# EAGLE schematic untitled (EAGLE 9.1.3)
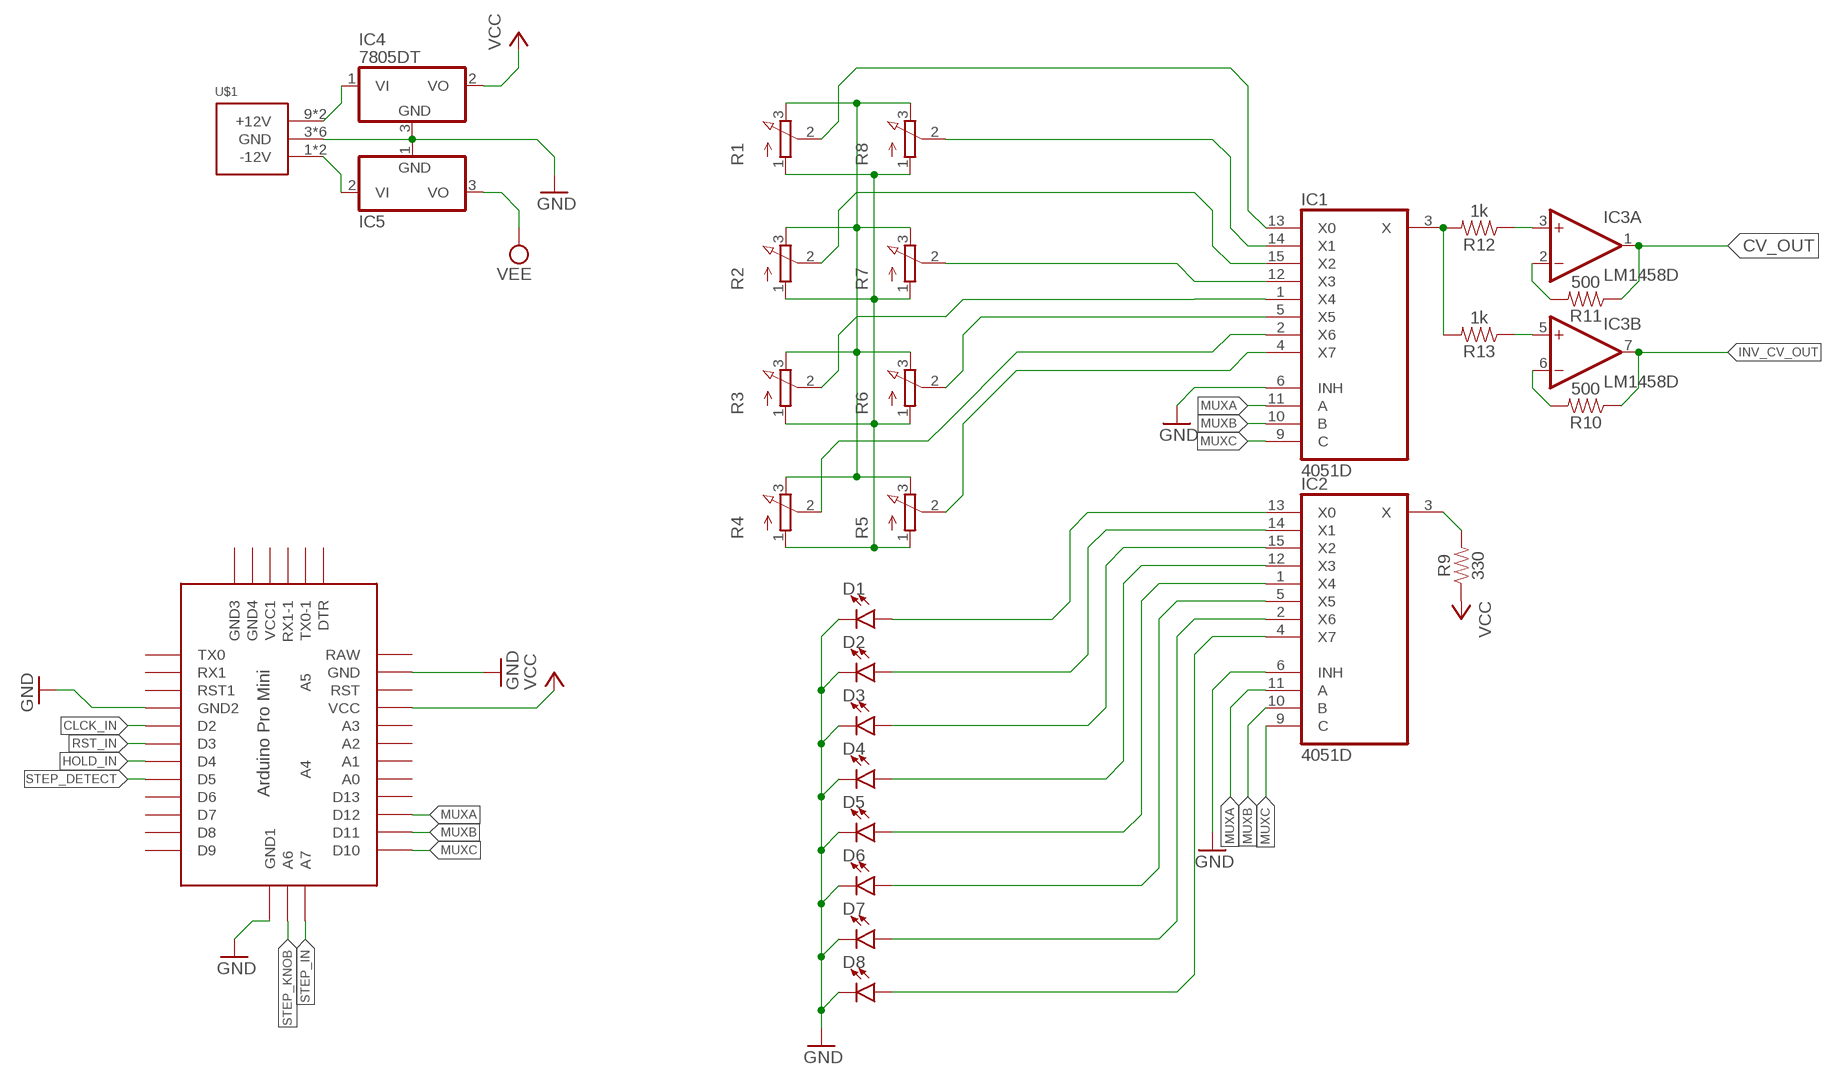
[diagram p0: schematic, sheet 1]

## Parts
D1  LED5MM  [LED_5MM]
D2  LED5MM  [LED_5MM]
D3  LED5MM  [LED_5MM]
D4  LED5MM  [LED_5MM]
D5  LED5MM  [LED_5MM]
D6  LED5MM  [LED_5MM]
D7  LED5MM  [LED_5MM]
D8  LED5MM  [LED_5MM]
IC1  4051D  [SO16]
IC2  4051D  [SO16]
IC3  LM1458D  [SO08]
IC4  7805DT  [TO252]
IC5  7905T  [TO220H]
R1  3RP/1610N  [3RP/1610N]
R2  3RP/1610N  [3RP/1610N]
R3  3RP/1610N  [3RP/1610N]
R4  3RP/1610N  [3RP/1610N]
R5  3RP/1610N  [3RP/1610N]
R6  3RP/1610N  [3RP/1610N]
R7  3RP/1610N  [3RP/1610N]
R8  3RP/1610N  [3RP/1610N]
R9  330  330OHM-HORIZ-1/10W-5%  [AXIAL-0.3]
R10  500  330OHM-HORIZ-1/10W-5%  [AXIAL-0.3]
R11  500  330OHM-HORIZ-1/10W-5%  [AXIAL-0.3]
R12  1k  330OHM-HORIZ-1/10W-5%  [AXIAL-0.3]
R13  1k  330OHM-HORIZ-1/10W-5%  [AXIAL-0.3]
U$1  POWER_SIMPLE10  [POWER_10]
U$2  ABK-PRO-MINI  [ABK-PRO-MINI]

## Nets
CLCK_IN: U$2.D2
CV_OUT: IC3.1(A:OUT) R11.P$1
GND: D1.K(C) D2.K(C) D3.K(C) D4.K(C) D5.K(C) D6.K(C) D7.K(C) D8.K(C) IC1.6(INH) IC2.6(INH) IC4.3(GND) IC5.1(GND) U$1.3(GND) U$1.4(GND) U$1.5(GND) U$1.6(GND) U$1.7(GND) U$1.8(GND) U$2.GND U$2.GND1(GND2) U$2.GND4(GND1)
HOLD_IN: U$2.D4
INV_CV_OUT: IC3.7(B:OUT) R10.P$1
MUXA: IC1.11(A) IC2.11(A) U$2.D12
MUXB: IC1.10(B) IC2.10(B) U$2.D11
MUXC: IC1.9(C) IC2.9(C) U$2.D10
N$1: D1.A IC2.13(X0)
N$2: D2.A IC2.14(X1)
N$3: D3.A IC2.15(X2)
N$4: D4.A IC2.12(X3)
N$5: D5.A IC2.1(X4)
N$6: D6.A IC2.5(X5)
N$7: D7.A IC2.2(X6)
N$8: D8.A IC2.4(X7)
N$9: R1.3(E) R2.3(E) R3.3(E) R4.3(E) R5.3(E) R6.3(E) R7.3(E) R8.3(E)
N$10: IC2.3(X) R9.P$2
N$12: IC1.13(X0) R1.2(S)
N$13: IC1.14(X1) R8.2(S)
N$14: IC1.15(X2) R2.2(S)
N$15: IC1.12(X3) R7.2(S)
N$16: R1.1(A) R2.1(A) R3.1(A) R4.1(A) R5.1(A) R6.1(A) R7.1(A) R8.1(A)
N$17: IC3.3(A:+IN) R12.P$1
N$18: IC1.1(X4) R3.2(S)
N$19: IC1.2(X6) R4.2(S)
N$20: IC1.5(X5) R6.2(S)
N$21: IC1.4(X7) R5.2(S)
N$24: IC3.6(B:-IN) R10.P$2
N$25: IC4.1(VI) U$1.9(+12V) U$1.10(+12V)
N$26: IC5.2(VI) U$1.1(-12V) U$1.2(-12V)
N$27: IC1.3(X) R12.P$2 R13.P$2
N$29: IC3.2(A:-IN) R11.P$2
RST_IN: U$2.D3
STEP_DETECT: U$2.D5
STEP_IN: U$2.A7
STEP_KNOB: U$2.A6
TRANS_IN: IC3.5(B:+IN) R13.P$1
VCC: IC4.2(VO) R9.P$1 U$2.VCC
VEE: IC5.3(VO)
Unconnected: U$2.A0 U$2.A1 U$2.A2 U$2.A3 U$2.A4 U$2.A5 U$2.D6 U$2.D7 U$2.D8 U$2.D9 U$2.D13 U$2.DTR U$2.GND2(GND3) U$2.GND3(GND4) U$2.RAW U$2.RST U$2.RST1 U$2.RX1 U$2.RX1-1 U$2.TX0 U$2.TX0-1 U$2.VCC1

## Power pins joined to a net without a drawn wire
GND: IC1.8(GND) IC2.8(GND)
V+: IC3.8(P:V+)
V-: IC3.4(P:V-)
VCC: IC1.16(VCC) IC2.16(VCC)
VEE: IC1.7(VEE) IC2.7(VEE)

## Library data of the parts
D1-D8 = SparkFun-LED:LED: LED (Generic) Standard schematic elements and footprints for 5mm, 3mm, 1206, and 0603 sized LEDs. Generic LEDs with no color specified.
IC1 IC2 = 40xx:4051: 8-channel ANALOG MULTIPLEXER
IC3 = linear:*1458: OP AMP
IC4 = linear:78*: Positive VOLTAGE REGULATOR Source: http://cache.national.com/ds/LM/LM78L05.pdf http://www.fairchildsemi.com/ds/LM/LM7805.pdf
IC5 = linear:79*: Negative VOLTAGE REGULATOR
R1-R8 = pot:3RP/1610N: 16mm Potentiometer one level Source: http://www.alphapotentiometers.net/html/16mm_pot_2.html
R9 = SparkFun-Resistors:330OHM: 330Ω resistor A resistor is a passive two-terminal electrical component that implements electrical resistance as a circuit element. Resistors act to reduce current flow, and, at the same time, act to lower voltage levels within circuits. - Wikipedia; PROD_ID: RES-8371
R10-R13 = SparkFun-Resistors:330OHM: 330Ω resistor A resistor is a passive two-terminal electrical component that implements electrical resistance as a circuit element. Resistors act to reduce current flow, and, at the same time, act to lower voltage levels within circuits. - Wikipedia; PROD_ID: RES-8371; VALUE: 330
U$1 = eurorack:POWER_SIMPLE
U$2 = Arduino-clone:ABK-PRO-MINI: ABK Pro-Mini Arduino Clone